# Altium schematic sheet TX.SchDoc: {Наименование}
size 420 x 297 mm; DocumentNumber: ПЛАС.ХХХХХХ.ХХХ ХХ; SheetNumber: {}; SheetTotal: {}; PageSetup: Record=PageOptions|CenterHorizontal=False|CenterVertical=False|PrintScale=0.95|XCorrection=0.00|YCorrection=0.00|PrintKind=1|BorderSize=5000000|LeftOffset=0|BottomOffset=0|Orientation=1|PaperLength=1000|PaperWidth=1000|Scale=100|PaperSource=15|PrintQuality=600|MediaType=1|DitherType=10|PaperKind=A4|PrintScaleMode=1; Rule: PcbType=ProtelPcb
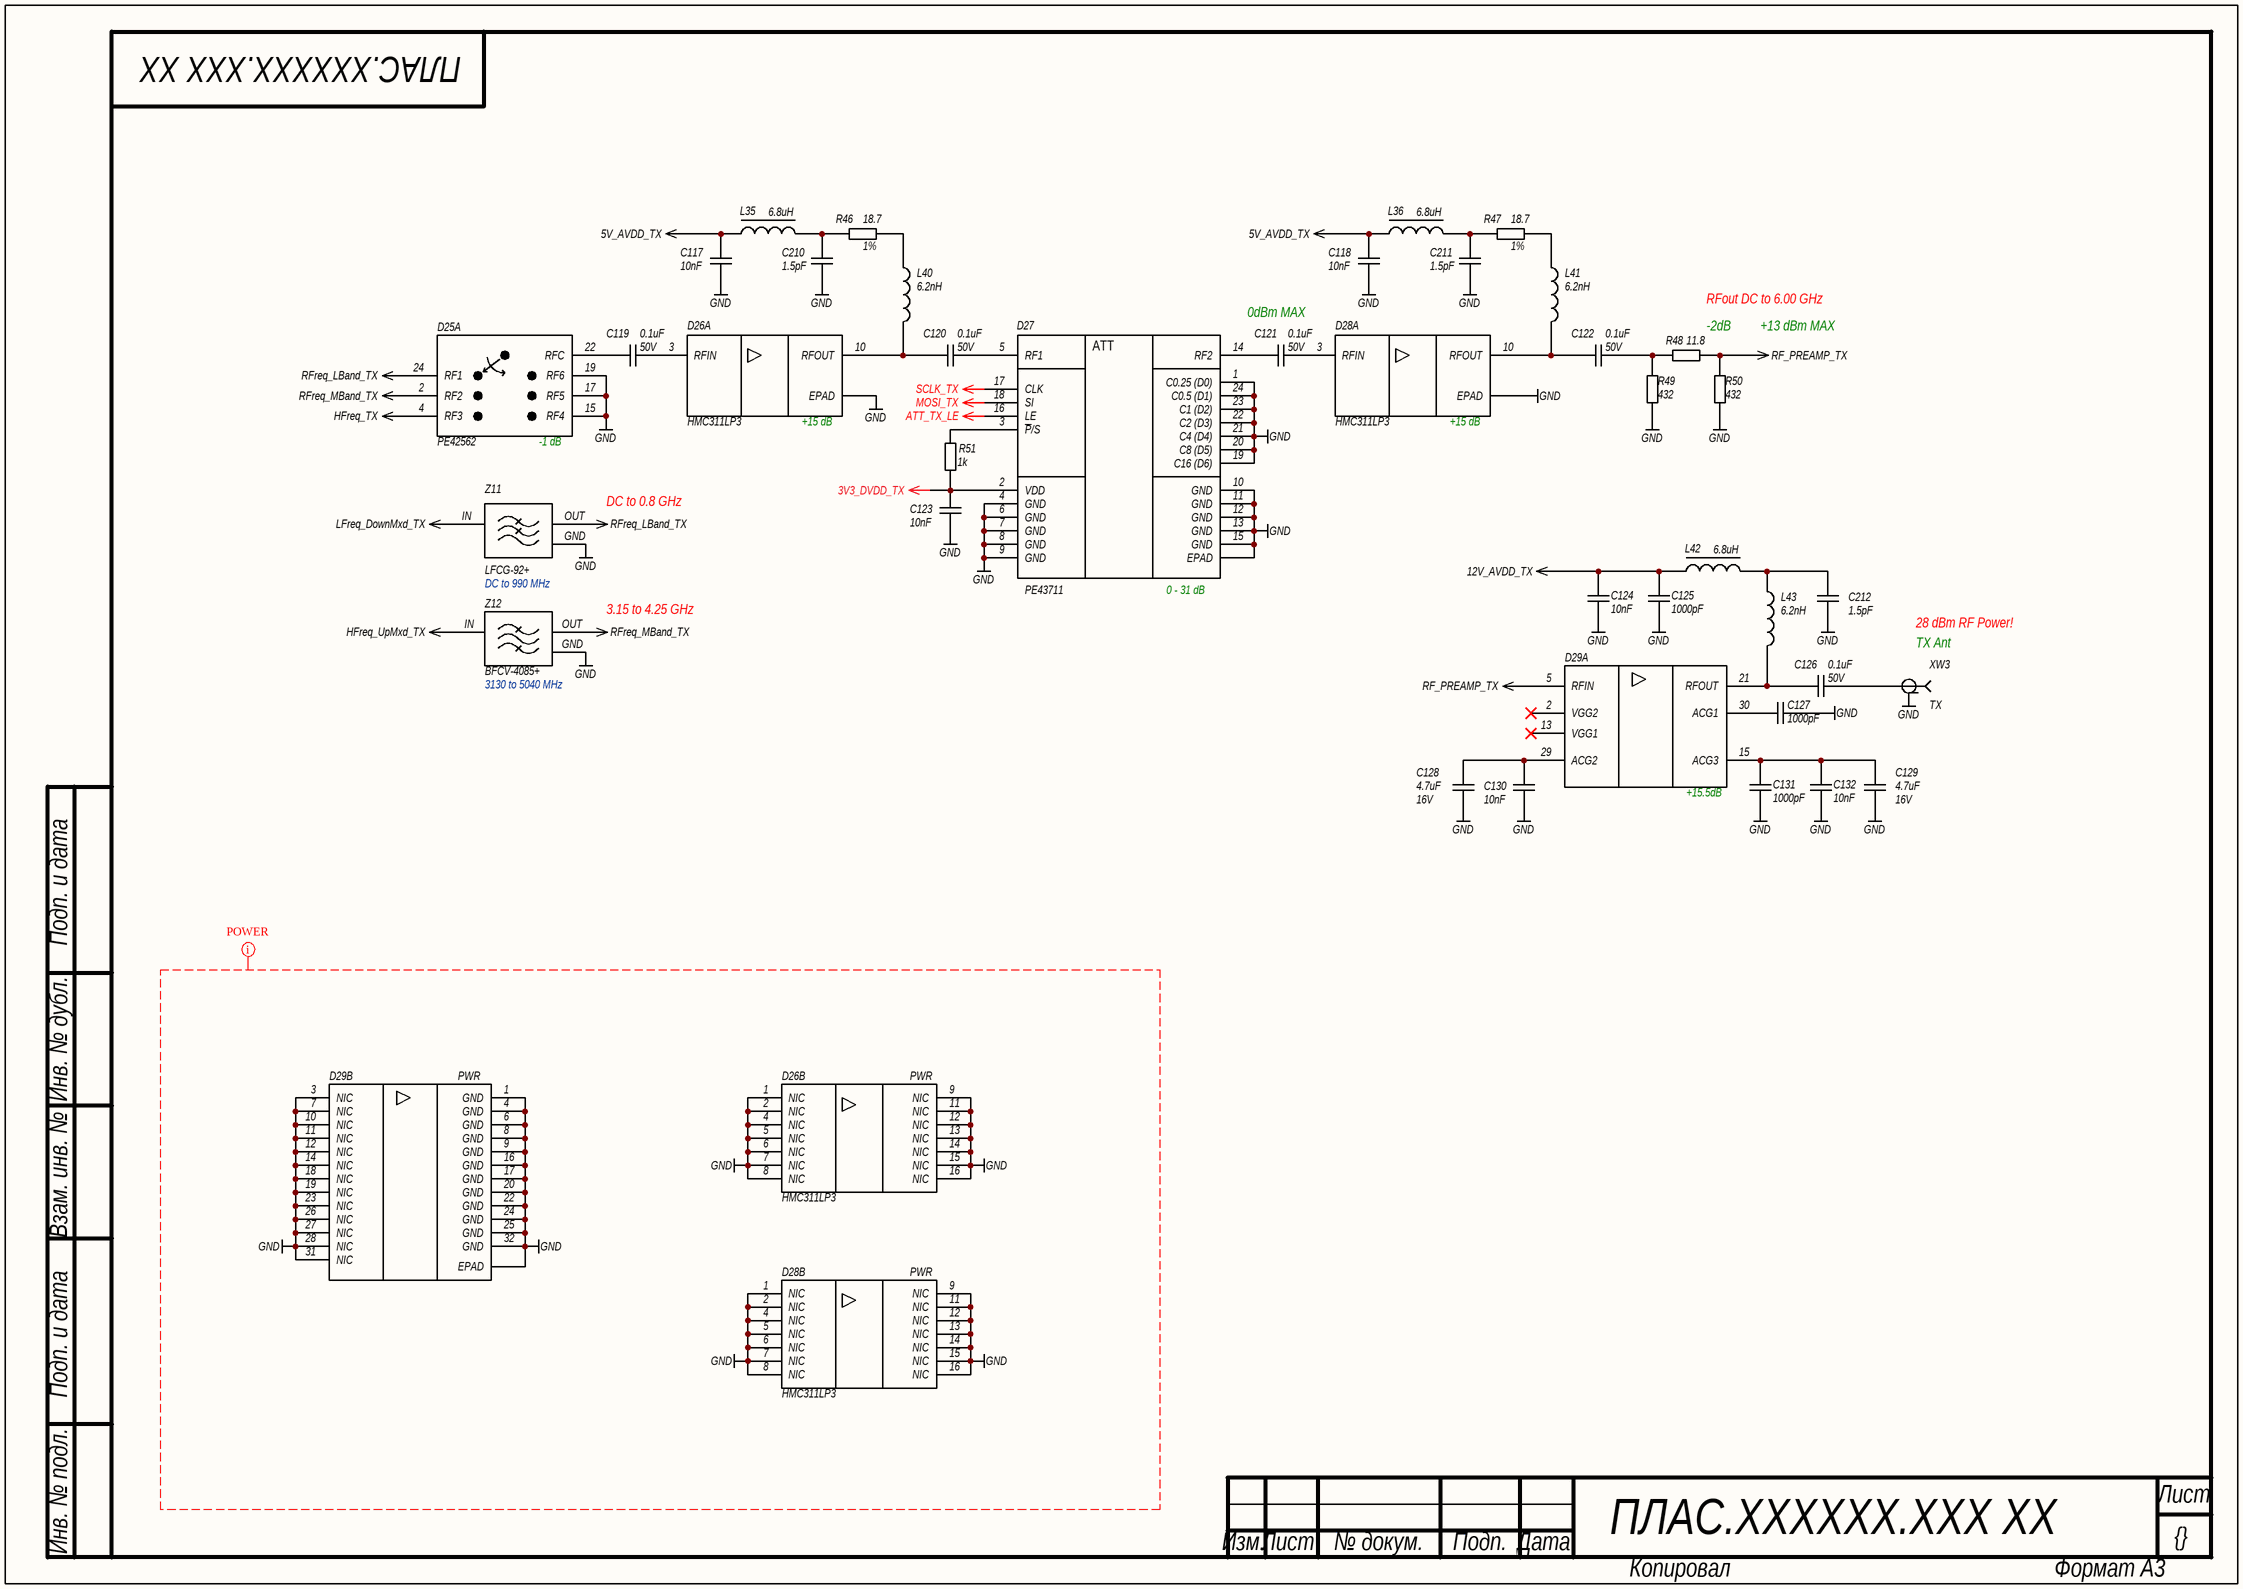
[diagram p0: TX.SchDoc]

## Parts
C117  value 10nF  [C0402]  (hidden comment: CAP)
C118  value 10nF  [C0402]  (hidden comment: CAP)
C119  value 0.1uF  Voltage: 50V  [C1206]  (hidden comment: CAP)
C120  value 0.1uF  Voltage: 50V  [C1206]  (hidden comment: CAP)
C121  value 0.1uF  Voltage: 50V  [C1206]  (hidden comment: CAP)
C122  value 0.1uF  Voltage: 50V  [C1206]  (hidden comment: CAP)
C123  value 10nF  [C0402]  (hidden comment: CAP)
C124  value 10nF  [C0402]  (hidden comment: CAP)
C125  value 1000pF  [C0402]  (hidden comment: CAP)
C126  value 0.1uF  Voltage: 50V  [C1206]  (hidden comment: CAP)
C127  value 1000pF  [C0402]  (hidden comment: CAP)
C128  value 4.7uF  Voltage: 16V  [C0603]  (hidden comment: CAP)
C129  value 4.7uF  Voltage: 16V  [C0603]  (hidden comment: CAP)
C130  value 10nF  [C0402]  (hidden comment: CAP)
C131  value 1000pF  [C0402]  (hidden comment: CAP)
C132  value 10nF  [C0402]  (hidden comment: CAP)
C210  value 1.5pF  [C0402]  (hidden comment: CAP)
C211  value 1.5pF  [C0402]  (hidden comment: CAP)
C212  value 1.5pF  [C0402]  (hidden comment: CAP)
D25  PE42562  [QFN-24]  (part A of 2)
D26  HMC311LP3  [QFN-16 v2]  (parts A,B of 2)
D27  PE43711  [QFN-24]
D28  HMC311LP3  [QFN-16 v2]  (parts A,B of 2)
D29  HMC637BPM5E  [LFCSP-32]  (value not drawn)  (parts A,B of 2)
L35  value 6.8uH  [XFL3012]  (hidden comment: Inductor)
L36  value 6.8uH  [XFL3012]  (hidden comment: Inductor)
L40  value 6.2nH  [L0805_HP]  (hidden comment: Inductor RF)
L41  value 6.2nH  [L0805_HP]  (hidden comment: Inductor RF)
L42  value 6.8uH  [XFL3012]  (hidden comment: Inductor)
L43  value 6.2nH  [L0805_HP]  (hidden comment: Inductor RF)
R46  value 18.7  Tolerance: 1%  [R0805]  (hidden comment: RES)
R47  value 18.7  Tolerance: 1%  [R0805]  (hidden comment: RES)
R48  value 11.8  [R0402]  (hidden comment: RES)
R49  value 432  [R0402]  (hidden comment: RES)
R50  value 432  [R0402]  (hidden comment: RES)
R51  value 1k  [R0402]  (hidden comment: RES)
XW3  TX  [MOLEX SD-73251-135 (Gold)]
Z11  LFCG-92+  Frequency: DC to 990 MHz  [GE0805C-2]
Z12  BFCV-4085+  Frequency: 3130 to 5040 MHz  [JV1210C]

## Nets
3V3_DVDD_TX: C123.2 D27.2(VDD) R51.1
5V_AVDD_TX: C117.2 C118.2 L35.1 L36.1
12V_AVDD_TX: C124.2 C125.2 L42.1
ATT_TX_LE: D27.16(LE)
GND: C117.1 C118.1 C123.1 C124.1 C125.1 C127.2 C128.2 C129.2 C130.1 C131.1 C132.1 C210.1 C211.1 C212.1 D25.15(RF4) D25.17(RF5) D25.19(RF6) D26.1(NIC) D26.2(NIC) D26.4(NIC) D26.5(NIC) D26.6(NIC) D26.7(NIC) D26.8(NIC) D26.9(NIC) D26.11(NIC) D26.12(NIC) D26.13(NIC) D26.14(NIC) D26.15(NIC) D26.16(NIC) D26.17(EPAD) D27.1(C0.25_(D0)) D27.4(GND) D27.6(GND) D27.7(GND) D27.8(GND) D27.9(GND) D27.10(GND) D27.11(GND) D27.12(GND) D27.13(GND) D27.15(GND) D27.19(C16_(D6)) D27.20(C8_(D5)) D27.21(C4_(D4)) D27.22(C2_(D3)) D27.23(C1_(D2)) D27.24(C0.5_(D1)) D27.25(EPAD) D28.1(NIC) D28.2(NIC) D28.4(NIC) D28.5(NIC) D28.6(NIC) D28.7(NIC) D28.8(NIC) D28.9(NIC) D28.11(NIC) D28.12(NIC) D28.13(NIC) D28.14(NIC) D28.15(NIC) D28.16(NIC) D28.17(EPAD) D29.0(EPAD) D29.1(GND) D29.3(NIC) D29.4(GND) D29.6(GND) D29.7(NIC) D29.8(GND) D29.9(GND) D29.10(NIC) D29.11(NIC) D29.12(NIC) D29.14(NIC) D29.16(GND) D29.17(GND) D29.18(NIC) D29.19(NIC) D29.20(GND) D29.22(GND) D29.23(NIC) D29.24(GND) D29.25(GND) D29.26(NIC) D29.27(NIC) D29.28(NIC) D29.31(NIC) D29.32(GND) R49.2 R50.2 XW3.G(GND) Z11.GND Z12.GND
HFreq_TX: D25.4(RF3)
HFreq_UpMxd_TX: Z12.IN
LFreq_DownMxd_TX: Z11.IN
MOSI_TX: D27.18(SI)
RF_PREAMP_TX: D29.5(RFIN) R48.1 R50.1
RFreq_LBand_TX: D25.24(RF1) Z11.OUT
RFreq_MBand_TX: D25.2(RF2) Z12.OUT
SCLK_TX: D27.17(CLK)
NetC119_1: C119.1 D26.3(RFIN)
NetC119_2: C119.2 D25.22(RFC)
NetC120_1: C120.1 D27.5(RF1)
NetC120_2: C120.2 D26.10(RFOUT) L40.1
NetC121_1: C121.1 D28.3(RFIN)
NetC121_2: C121.2 D27.14(RF2)
NetC122_1: C122.1 R48.2 R49.1
NetC122_2: C122.2 D28.10(RFOUT) L41.1
NetC126_1: C126.1 XW3.S(RF)
NetC126_2: C126.2 D29.21(RFOUT) L43.1
NetC127_1: C127.1 D29.30(ACG1)
NetC128_1: C128.1 C130.2 D29.29(ACG2)
NetC129_1: C129.1 C131.2 C132.2 D29.15(ACG3)
NetC210_2: C210.2 L35.2 R46.2
NetC211_2: C211.2 L36.2 R47.2
NetC212_2: C212.2 L42.2 L43.2
NetD27_3: D27.3(~{P}/S) R51.2
NetL40_2: L40.2 R46.1
NetL41_2: L41.2 R47.1

Not connected (* = marked no-connect by the designer): D29 2(VGG2)* 13(VGG1)*

## Layout directives
net class POWER: GND

## Notes on the sheet
- 0dBm MAX
- RFout DC to 6.00 GHz
- (near R48) -2dB
- +13 dBm MAX
- DC to 0.8 GHz
- 3.15 to 4.25 GHz
- (near XW3) TX Ant
- 28 dBm RF Power!
- Подп. и дата
- Инв. № дубл.
- Взам. инв. №
- Инв. № подл.
- Лист
- Изм.
- № докум.
- Подп.
- Дата
- Копировал
- Формат А3
- (in symbol HMC311LP3, part A) +15 dB
- (in symbol HMC311LP3, part B) PWR
- (in symbol HMC637BPM5E, part A) +15.5dB
- (in symbol HMC637BPM5E, part B) PWR
- (in symbol PE42562, part A) -1 dB
- (in symbol PE43711) ATT; 0 - 31 dB

## Library data of the parts
C117 C118 C123 C124 C130 C132 = CAP: SMD Capacitor; Manufacturer: Murata; Material: X7R; Tolerance: 10%; Voltage: 25V; Type: Ceramic Capacitor; P/N: GRM155R71E103KA01D
C119-C122 C126 = CAP: SMD Capacitor; Manufacturer: Murata; Material: NP0; Tolerance: 5%; Type: Ceramic Capacitor; P/N: GRM31C5C1H104JA01K
C125 C127 C131 = CAP: SMD Capacitor; Manufacturer: Murata; Material: NP0; Tolerance: 5%; Voltage: 50V; Type: Ceramic Capacitor; P/N: GRM1555C1H102JA01D
C128 C129 = CAP: SMD Capacitor; Manufacturer: Murata; Material: X5R; Tolerance: 10%; Type: Ceramic Capacitor; P/N: GRM188R61C475KAAJD
C210-C212 = CAP: SMD Capacitor; Manufacturer: Murata; Material: NP0; Tolerance: ±0.05pF; Voltage: 50V; Type: Ceramic Capacitor; P/N: GRM1555C1H1R5WA01D
D25 = PE42562: The PE42582 is a HaRP™ technology-enhanced absorptive SP6T RF switch; Manufacturer: Peregrine Technical Solutions; P/N: PE42562A-X; Name: PE42562; Package: 24-lead 4 × 4 × 0.85 mm QFN; Type: Absorptive SP6T RF switch
D26 D28 = HMC311LP3: InGaP HBT GAIN BLOCK; Manufacturer: Analog Devices; P/N: HMC311LP3E; Name: HMC311LP3; Package: 16 Lead 3x3mm SMT; Type: GAIN BLOCK
D27 = PE43711: The PE43711 is a 50Ω, HaRP™ technology-enhanced, 7-bit RF digital step attenuator; Manufacturer: Peregrine Technical Solutions; P/N: PE43711A-Z; Type: 7-bit RF digital step attenuator (DSA); Name: PE43711; Package: 24-lead 4 × 4 × 0.85 mm QFN; Supplier 1: Digi-Key; Supplier Part Number 1: 1046-1138-1-ND
D29 = HMC637BPM5E: 1 W Power Amplifier; Manufacturer: Analog Devices; Voltage: 12 V at 345 mA typical; Package: 32-lead, 5 mm × 5 mm LFCSP; Temperature Range: -40°C ~ 105°C; Type: Power Amplifier; P/N: HMC637BPM5E; Name: HMC637BPM5E
L35 L36 L42 = Inductor: Chip SMD Inductor; Manufacturer: Coilcraft; Current: 0.61A; Frequency: 39.9MHz; Name: XFL3012-682ME; Tolerance: ±5%; Series: XFL3012; Temperature Range: -25…85°C; P/N: XFL3012-682ME
L40 L41 L43 = Inductor RF: Chip SMD Inductor; Manufacturer: Coilcraft; Current: 1.5A; Frequency: 7200MHz; Name: 0805HP-6N2XJR; Tolerance: 5%; Series: 0805HP; Temperature Range: -25…85°C; P/N: 0805HP-6N2XJR
R46 R47 = RES: SMD Resistor; Manufacturer: Panasonic Electronic Components; Name: Chip SMD Resistor; Power: 0.125 Wt; P/N: ERJ-6ENF18R7V; Temperature Range: -55…155°C
R48 = RES: SMD Resistor; Manufacturer: Panasonic Electronic Components; Name: Chip SMD Resistor; Power: 0.063 Wt; Tolerance: ±1%; P/N: ERJ-2RKF11R8X; Temperature Range: -55…155°C
R49 R50 = RES: SMD Resistor; Manufacturer: Panasonic Electronic Components; Name: Chip SMD Resistor; Power: 0.1 Wt; Tolerance: ±1%; P/N: ERJ-2RKF4320X; Temperature Range: -55…155°C
R51 = RES: SMD Resistor; Name: Chip SMD Resistor; Power: 0.062 Wt; Tolerance: 5%; P/N: ERJ-2GEJ102X; Temperature Range: -55…155°C
XW3 = RF Connector: 50 Ohms, SMA Jack, Vertica; Manufacturer: Molex; Impedance: 50Ω; P/N: 0732511352; Name: SMA Jack; Type: 50 Ohms, SMA Jack, Vertical, PCB SMT, Gold (Au) Body; Supplier 1: Digi-Key; Supplier Part Number 1: WM9458-ND
Z11 = LFCG-92+: Low Pass Filter; Manufacturer: Mini-Circuits; Name: LFCG-92+; P/N: LFCG-92+; Type: Low Pass Filter; Package: GE0805C-2
Z12 = BFCV-4085+: Bandpass Filter; Manufacturer: Mini-Circuits; Name: BFCV-4085+; P/N: BFCV-4085+; Type: Bandpass Filter; Package: JV1210C